# Altium schematic sheet Power.SchDoc
size 420 x 297 mm; SheetNumber: 1; SheetTotal: 4
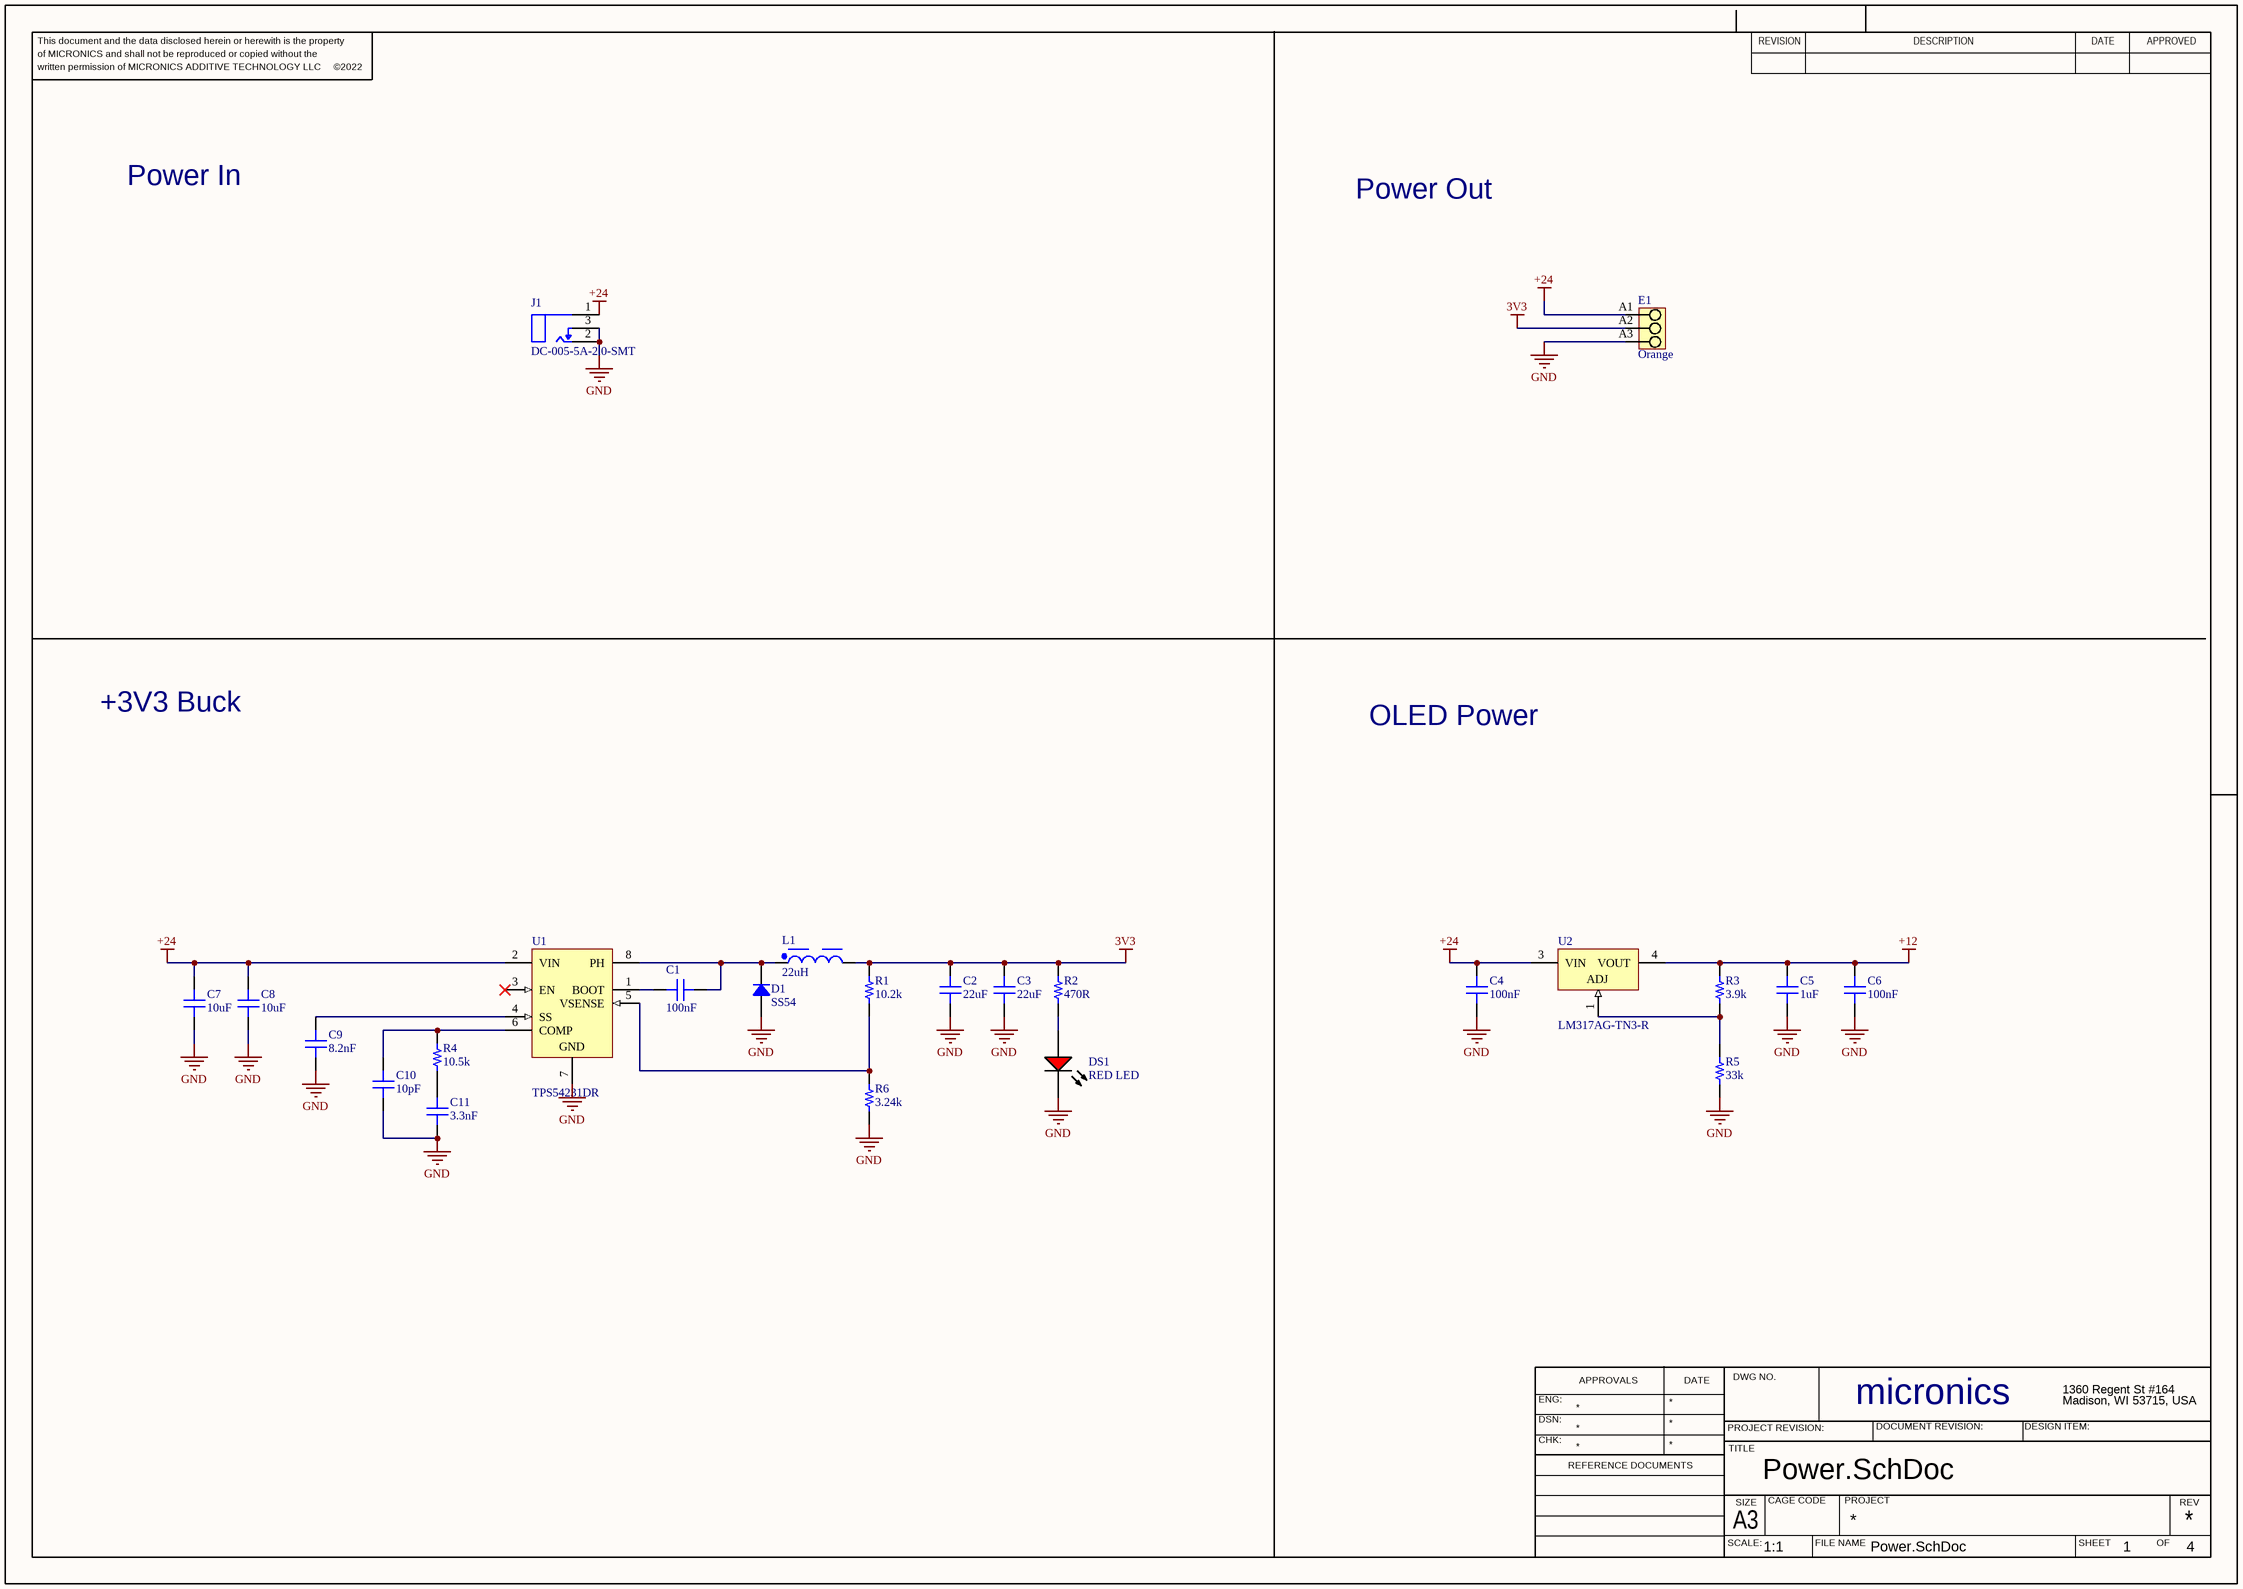
[diagram p0: Power.SchDoc]

## Parts
C1  100nF  [CAP 0603_1608]
C2  22uF  [CAP 1206_3216 - 0.8MM]
C3  22uF  [CAP 1206_3216 - 0.8MM]
C4  100nF  [CAP 0603_1608]
C5  1uF  [CAP 0603_1608]
C6  100nF  [CAP 0603_1608]
C7  10uF  [CAP 1206_3216 - 0.8MM]
C8  10uF  [CAP 1206_3216 - 0.8MM]
C9  8.2nF  [CAP 0603_1608]
C10  10pF  [CAP 0603_1608]
C11  3.3nF  [CAP 0603_1608]
D1  SS54  [DO214AC SMA]
DS1  RED LED  [VISH-TLMS1000_V]
E1  Orange  [PM_5_08_90_03]
J1  DC-005-5A-2.0-SMT  [FP-PJ-002BH-SMT-TR-MFG]
L1  22uH  [WE-PD_1050P]
R1  10.2k  [RES 0603_1608]
R2  470R  [RES 0603_1608]
R3  3.9k  [RES 0603_1608]
R4  10.5k  [RES 0603_1608]
R5  33k  [RES 0603_1608]
R6  3.24k  [RES 0603_1608]
U1  TPS54231DR  [D0008A_L]
U2  LM317AG-TN3-R  [TO-252_L]

## Nets
3V3: C2.2 C3.2 E1.A2 L1.2 R1.2 R2.2
+12: C5.1 C6.1 R3.2 U2.4(VOUT)
+24: C4.1 C7.2 C8.2 E1.A1 J1.1 U1.2(VIN) U2.3(VIN)
GND: C2.1 C3.1 C4.2 C5.2 C6.2 C7.1 C8.1 C9.1 C10.1 C11.1 D1.1 DS1.2(K) E1.A3 J1.2 J1.3 R5.1 R6.1 U1.7(GND)
NetC1_1: C1.1 D1.2 L1.1 U1.8(PH)
NetC1_2: C1.2 U1.1(BOOT)
NetC9_2: C9.2 U1.4(SS)
NetC10_2: C10.2 R4.2 U1.6(COMP)
NetC11_2: C11.2 R4.1
NetDS1_1: DS1.1(A) R2.1
NetR1_1: R1.1 R6.2 U1.5(VSENSE)
NetR3_1: R3.1 R5.2 U2.1(ADJ)

Not connected (* = marked no-connect by the designer): U1 3(EN)*

## Notes on the sheet
- Power In
- Power Out
- +3V3 Buck
- OLED Power
- This document and the data disclosed herein or herewith is the property
- of MICRONICS and shall not be reproduced or copied without the
- REVISION
- DESCRIPTION
- DATE
- APPROVED
- written permission of MICRONICS ADDITIVE TECHNOLOGY LLC     ©2022
- ENG:
- APPROVALS
- DWG NO.
- micronics
- 1360 Regent St #164
- Madison, WI 53715, USA
- DSN:
- CHK:
- REFERENCE DOCUMENTS
- PROJECT REVISION:
- TITLE
- DOCUMENT REVISION:
- DESIGN ITEM:
- SCALE:
- A3
- SIZE
- CAGE CODE
- FILE NAME
- PROJECT
- SHEET
- OF
- REV
- 1:1

## Library data of the parts
C1 = 250X14W223MV4T: C14663; manufacturer: Johanson Dielectrics Inc.; Temperature Coefficient: X7R; Tolerance: ±20%; Voltage - Rated: 25V; Part Number: 250X14W223MV4T; Value: 100nF; Applications: Bypass, Decoupling; Capacitance: 100nF; componentlink1description: Datasheet; componentlink1url: https://www.johansondielectrics.com/downloads/x2y-filter-and-decoupling-capacitors.pdf; componentlink2description: DigiKey Link; componentlink2url: https://www.digikey.com/en/products/detail/johanson-dielectrics-inc/250X14W223MV4T/1628740; Device Package: 0603 (1608 Metric); Features: Low ESL (X2Y); lastupdated: 2022-05-16 11:25:57 AM; Lifecycle Status: Active; Minimum Order: 1; Mounting Type: Surface Mount, MLCC; Operating Temperature: -55°C ~ 125°C; Package / Case: 0603 (1608 Metric); packaging: TapeAndReel; partid: 14325; Part Status: Active; price: 0.07; series: X2Y®; Size / Dimension: 0.064" L x 0.035" W (1.63mm x 0.89mm); Supplier 1: DigiKey; Supplier Part Number 1: 709-1087-1-ND; Thickness (Max): 0.026" (0.66mm)
C2 C3 = MM061A101JCT2A: C12891; manufacturer: AVX Corporation; Temperature Coefficient: C0G, NP0; Tolerance: ±5%; Voltage - Rated: 100V; Part Number: MM061A101JCT2A; Value: 22uF; Applications: Medical, Non-Critical; Capacitance: 22uF; componentlink1description: Datasheet; componentlink1url: http://datasheets.avx.com/AVX-MM.pdf; componentlink2description: DigiKey Link; componentlink2url: http://digikey.com/product-detail/en/avx-corporation/MM061A101JCT2A/478-10622-1-ND/7344883; Device Package: 1206 (3216 Metric); lastupdated: 2020-09-02 1:04:46 AM; Lifecycle Status: Active; Minimum Order: 1; Mounting Type: Surface Mount, MLCC; Operating Temperature: -55°C ~ 125°C; Package / Case: 1206 (3216 Metric); packaging: TapeAndReel; partid: 18685; Part Status: Active; price: 0.52; series: MM; Size / Dimension: 0.126" L x 0.063" W (3.20mm x 1.60mm); Supplier 1: DigiKey; Supplier Part Number 1: 478-10622-1-ND; Thickness (Max): 0.029" (0.74mm)
C4-C6 = 250X14W223MV4T: CAP CER 0.022UF 25V X7R 0603; manufacturer: Johanson Dielectrics Inc.; Tolerance: ±20%; Part Number: 250X14W223MV4T; Applications: Bypass, Decoupling; componentlink1description: Datasheet; componentlink1url: https://www.johansondielectrics.com/downloads/x2y-filter-and-decoupling-capacitors.pdf; componentlink2description: DigiKey Link; componentlink2url: https://www.digikey.com/en/products/detail/johanson-dielectrics-inc/250X14W223MV4T/1628740; Device Package: 0603 (1608 Metric); Features: Low ESL (X2Y); lastupdated: 2022-05-20 2:39:33 PM; Lifecycle Status: Active; Minimum Order: 1; Mounting Type: Surface Mount, MLCC; Operating Temperature: -55°C ~ 125°C; Package / Case: 0603 (1608 Metric); packaging: TapeAndReel; partid: 14325; Part Status: Active; price: 0.07; series: X2Y®; Size / Dimension: 0.064" L x 0.035" W (1.63mm x 0.89mm); Supplier 1: DigiKey; Supplier Part Number 1: 709-1087-1-ND; Temperature Coefficient: X7R; Thickness (Max): 0.026" (0.66mm); Voltage - Rated: 25V
  C4 C6: Value: 100nF; Capacitance: 100nF
  C5: Value: 1uF; Capacitance: 1uF
C7 C8 = MM061A101JCT2A: C13585; manufacturer: AVX Corporation; Temperature Coefficient: C0G, NP0; Tolerance: ±5%; Voltage - Rated: 100V; Part Number: MM061A101JCT2A; Value: 10uF; Applications: Medical, Non-Critical; Capacitance: 10uF; componentlink1description: Datasheet; componentlink1url: http://datasheets.avx.com/AVX-MM.pdf; componentlink2description: DigiKey Link; componentlink2url: http://digikey.com/product-detail/en/avx-corporation/MM061A101JCT2A/478-10622-1-ND/7344883; Device Package: 1206 (3216 Metric); lastupdated: 2020-09-02 1:04:46 AM; Lifecycle Status: Active; Minimum Order: 1; Mounting Type: Surface Mount, MLCC; Operating Temperature: -55°C ~ 125°C; Package / Case: 1206 (3216 Metric); packaging: TapeAndReel; partid: 18685; Part Status: Active; price: 0.52; series: MM; Size / Dimension: 0.126" L x 0.063" W (3.20mm x 1.60mm); Supplier 1: DigiKey; Supplier Part Number 1: 478-10622-1-ND; Thickness (Max): 0.029" (0.74mm)
C9-C11 = 250X14W223MV4T: manufacturer: Johanson Dielectrics Inc.; Temperature Coefficient: X7R; Tolerance: ±20%; Voltage - Rated: 25V; Part Number: 250X14W223MV4T; Applications: Bypass, Decoupling; componentlink1description: Datasheet; componentlink1url: https://www.johansondielectrics.com/downloads/x2y-filter-and-decoupling-capacitors.pdf; componentlink2description: DigiKey Link; componentlink2url: https://www.digikey.com/en/products/detail/johanson-dielectrics-inc/250X14W223MV4T/1628740; Device Package: 0603 (1608 Metric); Features: Low ESL (X2Y); lastupdated: 2022-05-16 11:25:57 AM; Lifecycle Status: Active; Minimum Order: 1; Mounting Type: Surface Mount, MLCC; Operating Temperature: -55°C ~ 125°C; Package / Case: 0603 (1608 Metric); packaging: TapeAndReel; partid: 14325; Part Status: Active; price: 0.07; series: X2Y®; Size / Dimension: 0.064" L x 0.035" W (1.63mm x 0.89mm); Supplier 1: DigiKey; Supplier Part Number 1: 709-1087-1-ND; Thickness (Max): 0.026" (0.66mm)
  C9: Value: 8.2nF; Capacitance: 8.2nF
  C10: Value: 10pF; Capacitance: 10pF
  C11: Value: 3.3nF; Capacitance: 3.3nF
D1 = RS1A: Manufacturer: ON Semiconductor; Capacitance @ Vr, F: 10pF @ 4V, 1MHz; Current - Average Rectified (Io): 1A; Current - Reverse Leakage @ Vr: 5µA @ 50V; Diode Type: Standard; Reverse Recovery Time (trr): 150ns; Speed: Fast Recovery =< 500ns, > 200mA (Io); Voltage - DC Reverse (Vr) (Max): 50V; Voltage - Forward (Vf) (Max) @ If: 1.3V @ 1A; Part Number: SS54; ComponentLink1Description: Datasheet; ComponentLink1URL: https://www.onsemi.com/pub/Collateral/RS1M-D.PDF; ComponentLink2Description: DigiKey Link; ComponentLink2URL: http://digikey.com/product-detail/en/on-semiconductor/RS1A/RS1ACT-ND/3504478; LastUpdated: 2022-05-20 3:23:52 PM; Lifecycle Status: Active; Minimum Order: 1; Mounting Type: Surface Mount; Operating Temperature - Junction: -55°C ~ 150°C; Package / Case: DO-214AC, SMA; Packaging: TapeAndReel; PartId: 585; Part Status: Active; Price: 0.08; Series: -; Supplier 1: DigiKey; Supplier Part Number 1: RS1ACT-ND; Supplier Device Package: SMA (DO-214AC)
DS1 = CMP-2000-07254-1: 0603 LED; Manufacturer: Vishay; Lens Shape: Rectangular; LED Mounting: SMD; Automotive Qualification Standard: AEC-Q100; Wavelength Typ: 636nm; SVHC: ToBeAdvised; Bulb Size: 1.6mmx0.8mm; Forward Voltage: 1.8V; Luminous Intensity: 4mcd; Forward Current If: 2mA; Viewing Angle: 80°; Datasheet Version: Rev. 1.7, 02/2011; Datasheet URL: https://datasheet.ciiva.com/5798/1698881-5798337.pdf; Packaging: CutTape; Package Reference: TLMS1000; Manufacturer URL: http://www.vishay.com/; Mounting Technology: SurfaceMount; Product Range: -; LED Colour: Red; Package Description: 2-Pin Surface Mount Device, Body 1.6 x 0.8 mm; MSL: MSL2-1year
E1 = CMP-1559-01629-1: C430604; PartNumber: 1760500000; Manufacturer: Weidmueller; Pitch_mm: 5,08 mm; Pitch_inch: 0,2 inch; Wire_cross_section_AWG_min_UL_1059: AWG 26; Contact_surface: tinned; Contact_material: Cu-Leg; Short_text_for_material: PM 5.08/03/90 3.5SN OR BX; Rated_voltage_use_group_B_UL_1059: 300 V; Solid_min_H05_07_V_U: 0,13 mm²; Solder_pin_length_mm: 3,5 mm; Rated_voltage_for_surge_voltage_class_pollution_degree_II_2: 600 V; Mounting_onto_the_PCB: Solder connection; Solid_max_H05_07_V_U: 2,5 mm²; Side_termination_characteristic: closed side; Rated_current_use_group_B_UL_1059: 15 A; Wire_cross_section_AWG_max_UL_1059: AWG 14; Insulating_material: Wemid (PA); UL_94_flammability_rating: V-0; No_of_poles: 3; ComponentLink2Description: URL Link1; ComponentLink1Description: Manufacturer URL; ComponentLink2URL: http://catalog.weidmueller.com/catalog/Start.do?localeId=en&ObjectID=1760500000; ComponentLink1URL: http://www.weidmueller.com/; Qty: 500 PCS; Colour: Orange; Packaging: Box; Revision: V1; PackageReference: PM_5_08_90_03
J1 = CMP-2000-06897-2: C319134; Manufacturer: CUI Inc; Manufacturer Part Number: PJ-002BH-SMT-TR; Current Rating: 5A; Standoff Height: 0.1mm; Voltage Rating: 24V; Conn Gender: Male; Conn Orientation: Right Angle; Number Of Contacts: 3; Temperature Range Low: -25°C; Category: Conn; Package: 0; Device Class L2: Power Connectors; Contact Material: Nickel,Silver; Automotive: No; Mouser Description: 2.5 mm Center Pin, 5.0 A, Right Angle, Surface Mount (SMT), Dc Power Jack Connector; Device Class L3: unset; ComponentLink2URL: https://www.cuidevices.com/product/resource/digikeypdf/pj-002bh-smt-tr.pdf; Octopart: https://octopart.com/pj-002bh-smt-tr-cui-25947151; Lead Free: Yes; ComponentLink2Description: Datasheet; Digikey Description: CONN PWR JACK 2.5X5.5MM SOLDER; Height: 11.43mm; Temperature: -25°C to +85°C; RoHS: TRUE; Device Class L1: Connectors; Temperature Range High: +85°C
L1 = CMP-1396-00034-2: C2651173; NexarPartId: 22866943; Test Frequency: 100kHz; Inductance Tolerance: 20%; Inductance: 22µH; Core Material: Ferrite; Resistance: 50mΩ; DC Resistance (DCR): 42mΩ; Self Resonant Frequency: 14.5MHz; Max DC Current: 3A; Shielding: Shielded; Saturation Current: 3.6A; Min Operating Temperature: -40°C; Max Operating Temperature: 150°C; Case/Package: Nonstandard; Length: 10mm; Width: 10mm; Termination: SMD/SMT; Series Resistance: 50mΩ; Height: 5mm; Ambient Temperature Range Low: -40°C; RMS Current (Irms): 3A; Composition: Wirewound; Tolerance: 20%; REACH SVHC: Unknown; Depth: 10mm; Packaging: Tape & Reel (TR); Mount: Surface Mount; Height - Seated (Max): 5.0038mm; RoHS: Compliant; Number of Pins: 2; Ambient Temperature Range High: 110°C; Current Rating: 3A
R1-R6 = RNCF0603DTE23K2: RES 23.2K OHM 0.5% 1/10W 0603; Manufacturer: Stackpole Electronics Inc; Power (Watts): 0.1W, 1/10W; Temperature Coefficient: ±25ppm/°C; Part Number: RNCF0603DTE23K2; ComponentLink1Description: Datasheet; ComponentLink1URL: https://www.seielect.com/catalog/sei-rncf.pdf; ComponentLink2Description: DigiKey Link; ComponentLink2URL: https://www.digikey.com/en/products/detail/stackpole-electronics-inc/RNCF0603DTE23K2/6264115; Composition: Thin Film; Device Package: 0603 (1608 Metric); Features: Automotive AEC-Q200; Height - Seated (Max): 0.022" (0.55mm); LastUpdated: 2022-05-20 3:01:33 PM; Lifecycle Status: Active; Minimum Order: 1; Number of Terminations: 2; Operating Temperature: -55°C ~ 155°C; Package / Case: 0603 (1608 Metric); Packaging: TapeAndReel; PartId: 5426; Part Status: Active; Price: 0.01; Ratings: AEC-Q200; Series: RNCF; Size / Dimension: 0.061" L x 0.031" W (1.55mm x 0.80mm); Supplier 1: DigiKey; Supplier Part Number 1: RNCF0603DTE23K2CT-ND; Supplier Device Package: 0603; Tolerance: ±0.5%
  R1: Value: 10.2k; Resistance: 10.2k
  R2: Value: 470R; Resistance: 470R
  R3: Value: 3.9k; Resistance: 3.9k
  R4: Value: 10.5k; Resistance: 10.5k
  R5: Value: 33k; Resistance: 33k
  R6: Value: 3.24k; Resistance: 3.24k
U1 = CMP-0323-00207-3: Buck Step Down Regulator with 3.5 to 28 V Input and 0.8 to 25 V Output, -40 to 150 degC, 8-Pin SOIC (D), Green (RoHS & no Sb/Br); Manufacturer: Texas Instruments; Vout(Min)(V): 0.8; Iout(Max)(A): 2; SubFamily: Step-Down Regulator; Vin(Min)(V): 3.5; Rating: Catalog; Duty Cycle(Max)(%): 90; Switch Current Limit(Typ)(A): 2.3; Iq(Typ)(mA): 0.11; Regulated Outputs(#): 1; Vout(Max)(V): 25; Vin(Max)(V): 28; ComponentLink2Description: Package Specification; PackageVersion: revM, Jun-2011; Topology: Buck; PackageReference: D0008A; DatasheetVersion: SLUS851C; Code_JEDEC: MS-012AA; PartNumber: TPS54231DR; ComponentLink2URL: http://www.ti.com/litv/pdf/msoi002j; Eco-Plan: Green (RoHS & no Sb/Br); ComponentLink1URL: http://www.ti.com/general/docs/lit/getliterature.tsp?genericPartNumber=TPS54231&fileType=pdf; ComponentLink1Description: Datasheet; PackageDescription: 8-Pin Plastic Small Outline Integrated Circuit, 4.9 x 3.9 mm, Pitch 1.27 mm Pitch; ComponentLink3URL: Samples URL:http://www.ti.com/product/tps54231#samples; Mounting Technology: Surface Mount; ComponentLink3Description: URL Link1
U2 = CMP-0244-00074-1: C75510; DatasheetVersion: 1/02/2008; ComponentLink1Description: Manufacturer URL; PackageReference: TO-252; ComponentLink2Description: Datasheet; PackageDescription: 3-Pin Transistor Outline Package 2.28 mm Pitch, 9.7 mm Lead Span (DPAK); ComponentLink2URL: http://www.st.com/internet/com/TECHNICAL_RESOURCES/TECHNICAL_LITERATURE/DATASHEET/CD00000549.pdf; PackageVersion: 2011; ComponentLink1URL: http://www.st.com